# Altium schematic sheet 4.血压计.SchDoc
size A
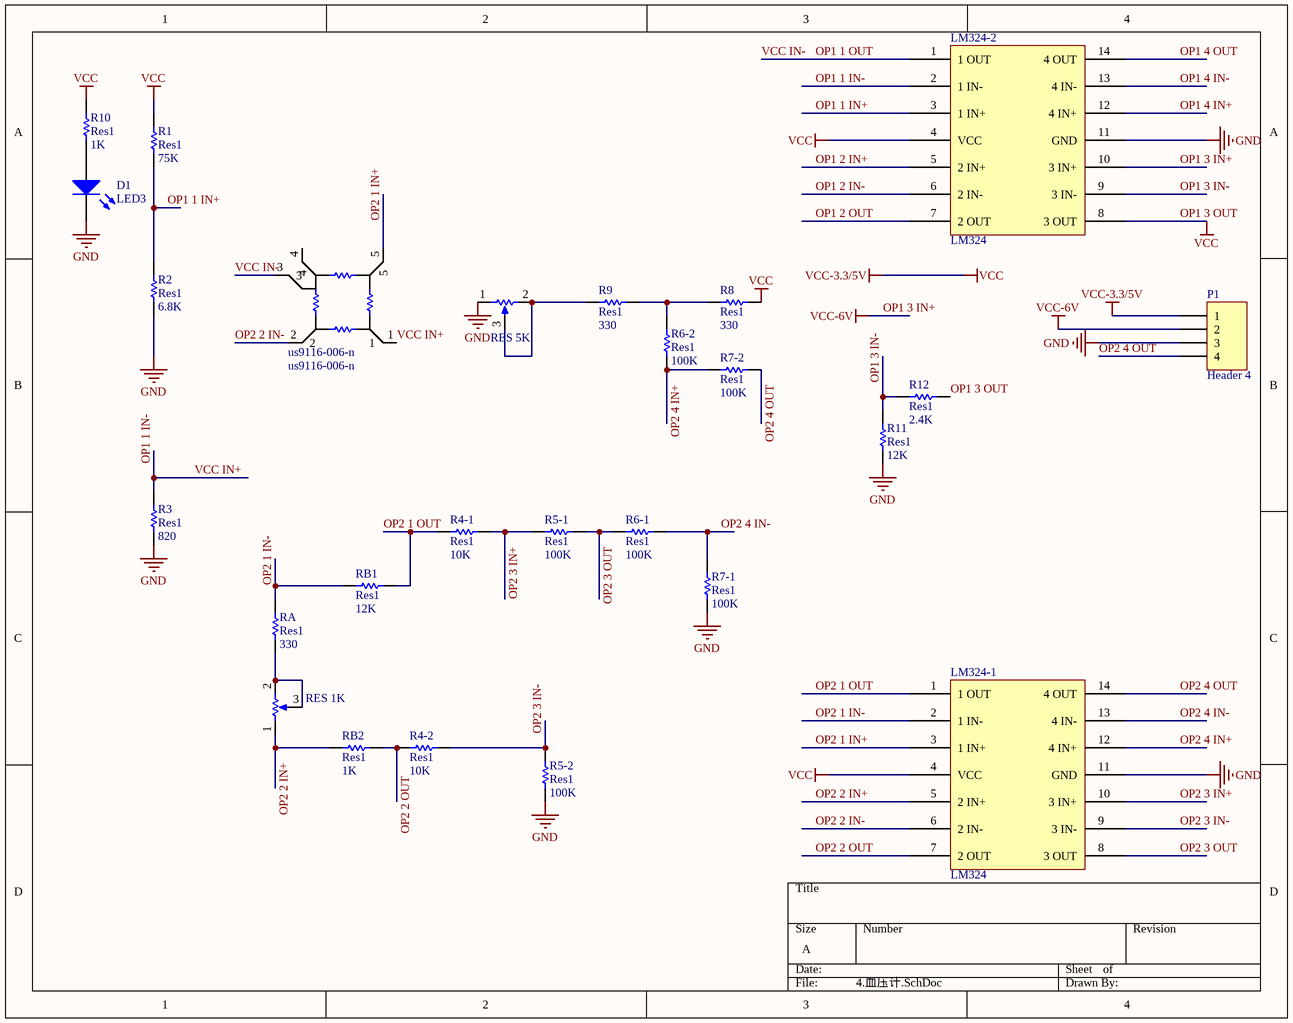
[diagram p0: 4.血压计.SchDoc]

## Parts
D1  LED3  [LED/CAP/RES 0603]
LM324-1  LM324  [LM324]
LM324-2  LM324  [LM324]
P1  Header 4  [HDR1X4]
R1  Res1  value 75K  [LED/CAP/RES 0603]
R2  Res1  value 6.8K  [LED/CAP/RES 0603]
R3  Res1  value 820  [LED/CAP/RES 0603]
R4-1  Res1  value 10K  [LED/CAP/RES 0603]
R4-2  Res1  value 10K  [LED/CAP/RES 0603]
R5-1  Res1  value 100K  [LED/CAP/RES 0603]
R5-2  Res1  value 100K  [LED/CAP/RES 0603]
R6-1  Res1  value 100K  [LED/CAP/RES 0603]
R6-2  Res1  value 100K  [LED/CAP/RES 0603]
R7-1  Res1  value 100K  [LED/CAP/RES 0603]
R7-2  Res1  value 100K  [LED/CAP/RES 0603]
R8  Res1  value 330  [LED/CAP/RES 0603]
R9  Res1  value 330  [LED/CAP/RES 0603]
R10  Res1  value 1K  [LED/CAP/RES 0603]
R11  Res1  value 12K  [LED/CAP/RES 0603]
R12  Res1  value 2.4K  [LED/CAP/RES 0603]
RA  Res1  value 330  [LED/CAP/RES 0603]
RB1  Res1  value 12K  [LED/CAP/RES 0603]
RB2  Res1  value 1K  [LED/CAP/RES 0603]
RES_1K  RES POT  [RES POT]  (value not drawn)
RES_5K  RES POT  [RES POT]  (value not drawn)
us9116-006-n  us9116-006-n  [us9116-006-n]

## Nets
GND: D1.2(K) LM324-1.11(GND) LM324-2.11(GND) P1.3 R2.1 R3.2 R5-2.2 R7-1.2 R11.2 RES_5K.1(TOP)
OP1 3 IN+: LM324-2.10(3_IN+) P1.2  [also labelled VCC-6V]
OP1 3 OUT: LM324-1.4(VCC) LM324-2.4(VCC) LM324-2.8(3_OUT) P1.1 R1.2 R8.1 R10.2 R12.1  [also labelled VCC, VCC-3.3/5V]
OP1 1 IN+: LM324-2.3(1_IN+) R1.1 R2.2
OP1 1 IN-: LM324-2.2(1_IN-) R3.1 us9116-006-n.1  [also labelled VCC IN+]
OP1 1 OUT: LM324-2.1(1_OUT) us9116-006-n.3  [also labelled VCC IN-]
OP1 2 IN+: LM324-2.5(2_IN+)
OP1 2 IN-: LM324-2.6(2_IN-)
OP1 2 OUT: LM324-2.7(2_OUT)
OP1 3 IN-: LM324-2.9(3_IN-) R11.1 R12.2
OP1 4 IN+: LM324-2.12(4_IN+)
OP1 4 IN-: LM324-2.13(4_IN-)
OP1 4 OUT: LM324-2.14(4_OUT)
OP2 1 IN+: LM324-1.3(1_IN+) us9116-006-n.5
OP2 1 IN-: LM324-1.2(1_IN-) RA.2 RB1.2
OP2 1 OUT: LM324-1.1(1_OUT) R4-1.2 RB1.1
OP2 2 IN+: LM324-1.5(2_IN+) RB2.2 RES_1K.1(TOP)
OP2 2 IN-: LM324-1.6(2_IN-) us9116-006-n.2
OP2 2 OUT: LM324-1.7(2_OUT) R4-2.2 RB2.1
OP2 3 IN+: LM324-1.10(3_IN+) R4-1.1 R5-1.2
OP2 3 IN-: LM324-1.9(3_IN-) R4-2.1 R5-2.1
OP2 3 OUT: LM324-1.8(3_OUT) R5-1.1 R6-1.2
OP2 4 IN+: LM324-1.12(4_IN+) R6-2.2 R7-2.1
OP2 4 IN-: LM324-1.13(4_IN-) R6-1.1 R7-1.1
OP2 4 OUT: LM324-1.14(4_OUT) P1.4 R7-2.2
NetD1_1: D1.1(A) R10.1
NetR6-2_1: R6-2.1 R8.2 R9.1
NetR9_2: R9.2 RES_5K.2(BOT) RES_5K.3(TAP)
NetRA_1: RA.1 RES_1K.2(BOT) RES_1K.3(TAP)

Not connected (* = marked no-connect by the designer): us9116-006-n 4

## Library data of the parts
D1 = LED3: Typical BLUE SiC LED; Published: 8-Jun-2000; LatestRevisionDate: 17-Dec-2003; LatestRevisionNote: PCB Footprint replaced.; DatasheetVersion: 16-Apr-2002; PackageVersion: 16-Apr-2002; PackageReference: 3.5X2.8X1.9; Publisher: Altium Limited; PackageDescription: SM LED; 2 C-Bend Leads; Body 3.5 x 2.8 x 1.9 mm, inc leads (LxWxH typ)
P1 = Header 4: Header, 4-Pin; LatestRevisionDate: 17-Jul-2002; LatestRevisionNote: Re-released for DXP Platform.; Publisher: Altium Limited
R1-R3 R4-1 R4-2 R5-1 R5-2 R6-1 R6-2 R7-1 R7-2 R8-R12 RA RB1 RB2 = Res1: Resistor; Published: 8-Jun-2000; LatestRevisionDate: 17-Jul-2002; LatestRevisionNote: Re-released for DXP Platform.; PackageReference: AXIAL-0.3; Publisher: Altium Limited; PackageDescription: Axial Device, Thru-Hole; 2 Leads; 0.3 in Pin Spacing